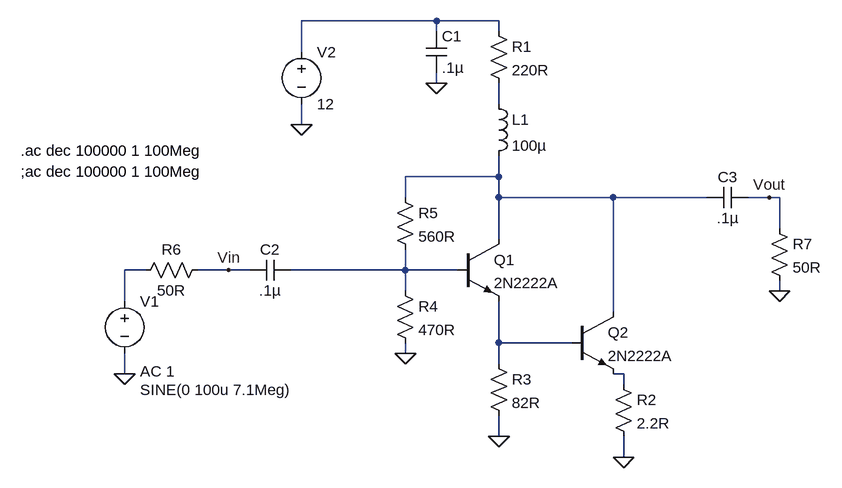
[diagram p0: schematic Sample MMIC Amp.asc]
Sample MMIC Amp.asc, the LTspice schematic file:
Version 4
SHEET 1 880 680
WIRE 240 -192 32 -192
WIRE 336 -192 240 -192
WIRE 240 -176 240 -192
WIRE 336 -176 336 -192
WIRE 32 -144 32 -192
WIRE 240 -96 240 -112
WIRE 336 -64 336 -96
WIRE 32 -32 32 -64
WIRE 336 48 336 16
WIRE 336 48 192 48
WIRE 192 80 192 48
WIRE 336 80 336 48
WIRE 512 80 336 80
WIRE 656 80 512 80
WIRE 752 80 720 80
WIRE 768 80 752 80
WIRE 768 128 768 80
WIRE 336 144 336 80
WIRE -208 192 -240 192
WIRE -80 192 -128 192
WIRE -48 192 -80 192
WIRE 192 192 192 160
WIRE 192 192 16 192
WIRE 272 192 192 192
WIRE 192 224 192 192
WIRE 768 224 768 208
WIRE -240 240 -240 192
WIRE 512 256 512 80
WIRE 336 304 336 240
WIRE 448 304 336 304
WIRE 192 320 192 304
WIRE 336 336 336 304
WIRE -240 352 -240 320
WIRE 528 352 512 352
WIRE 528 368 528 352
WIRE 336 448 336 416
WIRE 528 480 528 448
FLAG 32 -32 0
FLAG -240 352 0
FLAG 336 448 0
FLAG 528 480 0
FLAG 768 224 0
FLAG 240 -96 0
FLAG 192 320 0
FLAG 752 80 Vout
FLAG -80 192 Vin
SYMBOL voltage -240 224 R0
WINDOW 3 24 152 Left 2
WINDOW 123 24 124 Left 2
WINDOW 39 0 0 Left 2
SYMATTR InstName V1
SYMATTR Value SINE(0 100u 7.1Meg)
SYMATTR Value2 AC 1
SYMBOL voltage 32 -160 R0
WINDOW 123 0 0 Left 2
WINDOW 39 0 0 Left 2
SYMATTR InstName V2
SYMATTR Value 12
SYMBOL npn 272 144 R0
SYMATTR InstName Q1
SYMATTR Value 2N2222A
SYMBOL npn 448 256 R0
SYMATTR InstName Q2
SYMATTR Value 2N2222A
SYMBOL ind 320 -80 R0
SYMATTR InstName L1
SYMATTR Value 100µ
SYMBOL res 320 -192 R0
SYMATTR InstName R1
SYMATTR Value 220R
SYMBOL cap 224 -176 R0
SYMATTR InstName C1
SYMATTR Value .1µ
SYMBOL res 512 352 R0
SYMATTR InstName R2
SYMATTR Value 2.2R
SYMBOL res 320 320 R0
SYMATTR InstName R3
SYMATTR Value 82R
SYMBOL res 176 208 R0
SYMATTR InstName R4
SYMATTR Value 470R
SYMBOL res 176 64 R0
SYMATTR InstName R5
SYMATTR Value 560R
SYMBOL res -112 176 R90
WINDOW 0 0 56 VBottom 2
WINDOW 3 32 56 VTop 2
SYMATTR InstName R6
SYMATTR Value 50R
SYMBOL cap 16 176 R90
WINDOW 0 0 32 VBottom 2
WINDOW 3 32 32 VTop 2
SYMATTR InstName C2
SYMATTR Value .1µ
SYMBOL cap 720 64 R90
WINDOW 0 0 32 VBottom 2
WINDOW 3 32 32 VTop 2
SYMATTR InstName C3
SYMATTR Value .1µ
SYMBOL res 752 112 R0
SYMATTR InstName R7
SYMATTR Value 50R
TEXT -400 40 Left 2 !;ac dec 100000 1 100Meg
TEXT -400 8 Left 2 !.ac dec 100000 1 100Meg

The netlist it stands for:
* Sample MMIC Amp.asc
V1 N004 0 SINE(0 100u 7.1Meg) AC 1
V2 N001 0 12
Q1 N003 N005 N006 0 2N2222A
Q2 N003 N006 N007 0 2N2222A
L1 N002 N003 100µ
R1 N001 N002 220R
C1 N001 0 .1µ
R2 N007 0 2.2R
R3 N006 0 82R
R4 N005 0 470R
R5 N003 N005 560R
R6 Vin N004 50R
C2 N005 Vin .1µ
C3 Vout N003 .1µ
R7 Vout 0 50R
.model NPN NPN
.model PNP PNP
.lib standard.bjt
;ac dec 100000 1 100Meg
.ac dec 100000 1 100Meg
.backanno
.end